# EAGLE design Z1 (EAGLE 9.6.2)
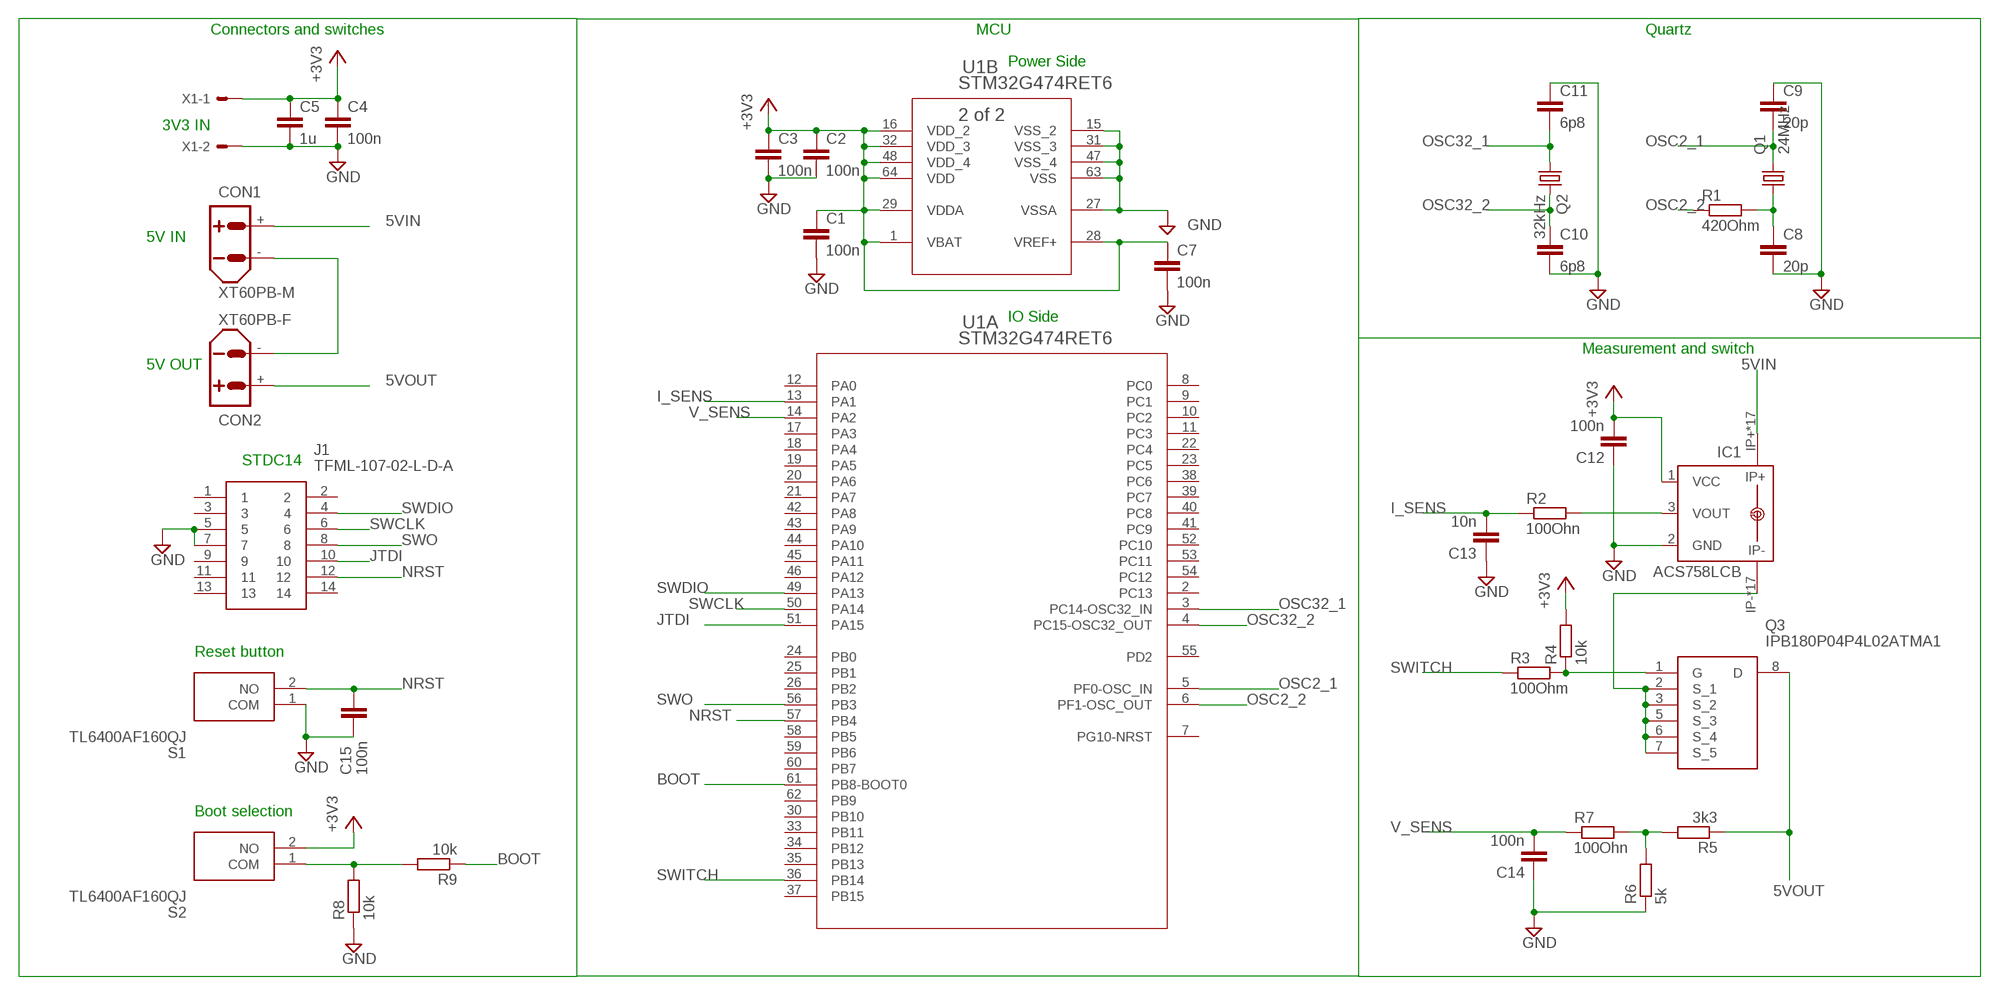
[diagram p0: schematic, sheet 1]

## Parts
C1  100n  C-EUC0402  [C0402]
C2  100n  C-EUC0402  [C0402]
C3  100n  C-EUC0402  [C0402]
C4  100n  C-EUC0402  [C0402]
C5  1u  C-EUC1206K  [C1206K]
C7  100n  C-EUC0402  [C0402]
C8  20p  C-EUC0402  [C0402]
C9  20p  C-EUC0402  [C0402]
C10  6p8  C-EUC0402  [C0402]
C11  6p8  C-EUC0402  [C0402]
C12  100n  C-EUC0402  [C0402]
C13  10n  C-EUC0402  [C0402]
C14  100n  C-EUC0402  [C0402]
C15  100n  C-EUC0402  [C0402]
CON1  XT60PB-M  [XT60PB-M]
CON2  XT60PB-F  [XT60PB-F]
IC1  ACS758LCB  ACS758LCB-050B-PFF-T  [CB-PFF]
J1  TFML-107-02-L-D-A  [TFML-107-02-XXX-D-A]
Q1  24MHz  KX-K  [11.4X4.5]
Q2  32kHz  FC-12M  [FC-12M]
Q3  IPB180P04P4L02ATMA1  [IPB180P04P4L02ATMA1]
R1  420Ohm  R-EU_R0603  [R0603]
R2  100Ohn  R-EU_R0603  [R0603]
R3  100Ohm  R-EU_R0603  [R0603]
R4  10k  R-EU_R0603  [R0603]
R5  3k3  R-EU_R0603  [R0603]
R6  5k  R-EU_R0603  [R0603]
R7  100Ohn  R-EU_R0603  [R0603]
R8  10k  R-EU_R0603  [R0603]
R9  10k  R-EU_R0603  [R0603]
S1  TL6400AF160QJ  [TL6400AF160QJ]
S2  TL6400AF160QJ  [TL6400AF160QJ]
U1  STM32G474RET6  [LQFP64-10X10MM]
X1  KK-156-2  [KK-156-2]

## Nets
5VIN: CON1.+ IC1.IP+ IC1.IP+@2(IP+) IC1.IP+@3(IP+) IC1.IP+@4(IP+) IC1.IP+@5(IP+) IC1.IP+@6(IP+) IC1.IP+@7(IP+) IC1.IP+@8(IP+) IC1.IP+@9(IP+) IC1.IP+@10(IP+) IC1.IP+@11(IP+) IC1.IP+@12(IP+) IC1.IP+@13(IP+) IC1.IP+@14(IP+) IC1.IP+@15(IP+) IC1.IP+@16(IP+) IC1.IP+@17(IP+)
5VOUT: CON2.+ Q3.8(D) R5.1
+3V3: C1.1 C2.1 C3.1 C4.1 C5.1 C7.1 C12.2 IC1.1(VCC) R4.2 S2.2(NO) U1.1(B:VBAT) U1.16(B:VDD_2) U1.28(B:VREF+) U1.29(B:VDDA) U1.32(B:VDD_3) U1.48(B:VDD_4) U1.64(B:VDD) X1.1
AXC: C8.1 Q1.1 R1.2
BOOT: R9.1 U1.61(A:PB8-BOOT0)
GND: C1.2 C2.2 C3.2 C4.2 C5.2 C7.2 C8.2 C9.1 C10.2 C11.1 C12.1 C13.1 C14.1 C15.2 IC1.2(GND) J1.5 J1.7 R6.1 R8.1 S1.1(COM) U1.15(B:VSS_2) U1.27(B:VSSA) U1.31(B:VSS_3) U1.47(B:VSS_4) U1.63(B:VSS) X1.2
I_SENS: C13.2 R2.1 U1.13(A:PA1)
JTDI: J1.10 U1.51(A:PA15)
N$1: CON1.- CON2.-
N$3: IC1.IP- IC1.IP-@2(IP-) IC1.IP-@3(IP-) IC1.IP-@4(IP-) IC1.IP-@5(IP-) IC1.IP-@6(IP-) IC1.IP-@7(IP-) IC1.IP-@8(IP-) IC1.IP-@9(IP-) IC1.IP-@10(IP-) IC1.IP-@11(IP-) IC1.IP-@12(IP-) IC1.IP-@13(IP-) IC1.IP-@14(IP-) IC1.IP-@15(IP-) IC1.IP-@16(IP-) IC1.IP-@17(IP-) Q3.2(S_1) Q3.3(S_2) Q3.5(S_3) Q3.6(S_4) Q3.7(S_5)
N$4: IC1.3(VOUT) R2.2
N$6: Q3.1(G) R3.2 R4.1
N$7: R5.2 R6.2 R7.2
N$8: R8.2 R9.2 S2.1(COM)
NRST: C15.1 J1.12 S1.2(NO) U1.57(A:PB4)
OSC2_1: C9.2 Q1.2 U1.5(A:PF0-OSC_IN)
OSC2_2: R1.1 U1.6(A:PF1-OSC_OUT)
OSC32_1: C11.2 Q2.1 U1.3(A:PC14-OSC32_IN)
OSC32_2: C10.1 Q2.2 U1.4(A:PC15-OSC32_OUT)
SWCLK: J1.6 U1.50(A:PA14)
SWDIO: J1.4 U1.49(A:PA13)
SWITCH: R3.1 U1.36(A:PB14)
SWO: J1.8 U1.56(A:PB3)
V_SENS: C14.2 R7.1 U1.14(A:PA2)
Unconnected: J1.1 J1.2 J1.3 J1.9 J1.11 J1.13 J1.14 U1.2(A:PC13) U1.7(A:PG10-NRST) U1.8(A:PC0) U1.9(A:PC1) U1.10(A:PC2) U1.11(A:PC3) U1.12(A:PA0) U1.17(A:PA3) U1.18(A:PA4) U1.19(A:PA5) U1.20(A:PA6) U1.21(A:PA7) U1.22(A:PC4) U1.23(A:PC5) U1.24(A:PB0) U1.25(A:PB1) U1.26(A:PB2) U1.30(A:PB10) U1.33(A:PB11) U1.34(A:PB12) U1.35(A:PB13) U1.37(A:PB15) U1.38(A:PC6) U1.39(A:PC7) U1.40(A:PC8) U1.41(A:PC9) U1.42(A:PA8) U1.43(A:PA9) U1.44(A:PA10) U1.45(A:PA11) U1.46(A:PA12) U1.52(A:PC10) U1.53(A:PC11) U1.54(A:PC12) U1.55(A:PD2) U1.58(A:PB5) U1.59(A:PB6) U1.60(A:PB7) U1.62(A:PB9)

## Notes on the sheet
- Connectors and switches | MCU | Quartz
- Power Side
- 3V3 IN
- 5V IN
- IO Side
- Measurement and switch
- 5V OUT
- STDC14
- Reset button
- Boot selection

## Library data of the parts
C1-C5 C7-C15 = rcl:C-EU: CAPACITOR, European symbol; SPICEPREFIX: C
CON1 CON2 = amass:XT60: AMASS XT60 connector Store in Japan AMASS XT60 connector <https://szc.jp/ams-xt60>
IC1 = allegro:ACS758*: Thermally Enhanced, Fully Integrated, Hall Effect-Based Linear Current Sensor with 100 micro Ohm Current Conductor display layer 49 Reference in BRD and place VIAs on circles Source: http://www.allegromicro.com/en/Products/Part_Numbers/0758/0758.pdf; MPN: ACS758LCB-050B-PFF-T; OC_FARNELL: 1718997; OC_NEWARK: 04R7131
J1 = TFML-107-02-L-D-A:TFML-107-02-L-D-A: Tiger Eye™ High-Reliability Locking Terminal Strip, 0.050" Pitch Source: Datasheet <https://componentsearchengine.com/Datasheets/1/TFML-107-02-L-D-A.pdf>; DESCRIPTION: Tiger Eye&trade; High-Reliability Locking Terminal Strip, 0.050&quot; Pitch; HEIGHT: mm; MANUFACTURER_NAME: SAMTEC; MANUFACTURER_PART_NUMBER: TFML-107-02-L-D-A; MOUSER_PART_NUMBER: 200-TFML10702LDA; MOUSER_PRICE-STOCK: https://www.mouser.com/Search/Refine.aspx?Keyword=200-TFML10702LDA
Q1 = crystal-geyer_V1_0:KX: Quartz Crystals (MHz) SMD: KX - Serie Model Size l/w/h [mm] Frequency Range Frequency Stability Temp. Range [°C] Load Capacitance AECQ 200 availabel Datasheet KX-4 KX-5 KX-6 KX-7 KX-9A KX-9B KX-12A KX-12B KX-13 KX-20 KX-K KX-KS 1.6/1.2/0.3 2.0/1.6/0.45 2.5/2.0/0.55 3.2/2.5/0.8 5.0/3.2/1.0 5.0/3.2/1.1 6.0/3.5/1.1 6.0/3.5/1.0 7.0/5.0 /1.3 11.6/5.5/1.6 12.3/4.5/4.2 12.3/4.5/3.2 24.0 ~ 80.0 MHz 16.0 ~ 80.0 MHz 12.0 ~ 80.0 MHz 8.0 ~ 60.0 MHz 7,68 ~ 300,0 MHz 8,0 ~ 50,0 MHz 8,0 ~ 150,0 MHz 8,0 ~ 50,0 MHz 6,0 ~ 160,0 MHz 3,579 ~ 25,0 MHz 3,579 ~ 70,0 MHz 3,579 ~ 70,0 MHz ±10 … ±50ppm ±10 … ±50ppm ±10 … ±50ppm ±10 … ±50ppm ±10 … ±50ppm ±10 … ±50ppm ±10 … ±50ppm ±10 … ±50ppm ±10 … ±50ppm ±50ppm ±10 … ±50ppm ±10 … ±50ppm (*) -40°C …+85°C (*) -40°C …+125°C (*) -40°C …+125°C (*) -40°C …+125°C (*) -40°C …+105°C (*) -40°C …+105°C (*) -40°C …+125°C (*) -40°C …+105°C (*) -40°C …+105°C (*) -40°C …+105°C (*) -40°C …+85°C (*) -40°C …+85°C 8, 8…16 8, 8…16 10, 8…16 12, 7…20 16, 10…20 16, 10…20 16, 10…20 16, 12…20 16, 12…20 16, 12…20 16, 12…30 16, 12…30 - yes yes yes - - - - - - - - KX-4.pdf <http://www.geyer-electronic.de/uploads/tx_userartikelfrequenz/GEYER-KX-4.pdf> KX-5.pdf <http://www.geyer-electronic.de/uploads/tx_userartikelfrequenz/GEYER-KX-5.pdf> KX-6.pdf <http://www.geyer-electronic.de/uploads/tx_userartikelfrequenz/GEYER-KX-6.pdf> KX-7.pdf <http://www.geyer-electronic.de/uploads/tx_userartikelfrequenz/GEYER-KX-7.pdf> KX-9A.pdf <http://www.geyer-electronic.de/uploads/tx_userartikelfrequenz/GEYER-KX-9A.pdf> KX-9B.pdf <http://www.geyer-electronic.de/uploads/tx_userartikelfrequenz/GEYER-KX-9B.pdf> KX-12A.pdf <http://www.geyer-electronic.de/uploads/tx_userartikelfrequenz/GEYER-KX-12A.pdf> KX-12B.pdf <http://www.geyer-electronic.de/uploads/tx_userartikelfrequenz/GEYER-KX-12B.pdf> KX-13.pdf <http://www.geyer-electronic.de/uploads/tx_userartikelfrequenz/GEYER-KX-13.pdf> KX-20.pdf <http://www.geyer-electronic.de/uploads/tx_userartikelfrequenz/GEYER-KX-20.pdf> KX-K.pdf <http://www.geyer-electronic.de/uploads/tx_userartikelfrequenz/GEYER-KX-K.pdf> KX-KS.pdf <http://www.geyer-electronic.de/uploads/tx_userartikelfrequenz/GEYER-KX-KS.pdf> <http://www.geyer-electronic.de/fileadmin/template/img/logo-geyer-electronic.png> Details see: http://www.geyer-electronic.de/Frequenz-Produkte.9.0.html Created 2016-06-07, Hans Locher 2016 (C) Geyer Quartz Technology KX4,KX5,KX6,KX7,KX9A,KX9B,KX12A,KX12B,KX13,KX20,KXK,KXKS;1612;2016;2520;3225;5032;6035;7050;11655;12345;1,6x1,2;2,0x1,6;2,5x2,0;3,2x2,5;5,0x3,2;6,0x3,5;7,0x5,0;11,6x5,5;12,3x4,5;12,3x4,5;1.6x1.2;2.0x1.6;2.5x2.0;3.2x2.5;5.0x3.2;6.0x3.5;7.0x5.0;11.6x5.5;12.3x4.5;12.3x4.5;
Q2 = crystal:FC-12M: kHz RANGE CRYSTAL UNIT LOW PROFILE SMD Source: Epson Toyocom FC-12M.pdf
Q3 = IPB180P04P4L02ATMA1:IPB180P04P4L02ATMA1: MOSFET P-Ch -40V -180A D2PAK-6 OptiMOS-P2., Source: Datasheet <https://datasheet.datasheetarchive.com/originals/distributors/DKDS-30/598184.pdf>; DESCRIPTION: MOSFET P-Ch -40V -180A D2PAK-6 OptiMOS-P2.,; HEIGHT: 4.5mm; MANUFACTURER_NAME: Infineon; MANUFACTURER_PART_NUMBER: IPB180P04P4L02ATMA1; MOUSER_PART_NUMBER: 726-IPB180P04P4L02AT; MOUSER_PRICE-STOCK: https://www.mouser.co.uk/ProductDetail/Infineon-Technologies/IPB180P04P4L02ATMA1?qs=OwbwYO03UsIwGcVH%2Fkzh3w%3D%3D
R1-R9 = rcl:R-EU_: RESISTOR, European symbol; SPICEPREFIX: R
S1 S2 = TL6400AF160QJ:TL6400AF160QJ: Tactile Switch SPST-NO Top Actuated Surface Mount Source: Datasheet <https://sten-eswitch-13110800-production.s3.amazonaws.com/system/asset/product_line/data_sheet/178/TL6700.pdf>; DESCRIPTION: Tactile Switch SPST-NO Top Actuated Surface Mount; HEIGHT: 4.3mm; MANUFACTURER_NAME: E-Switch; MANUFACTURER_PART_NUMBER: TL6400AF160QJ; MOUSER_PART_NUMBER: 612-TL6400AF160QJ; MOUSER_PRICE-STOCK: https://www.mouser.co.uk/ProductDetail/E-Switch/TL6400AF160QJ?qs=t7xnP681wgXh9NC1jPxNOA%3D%3D
U1 = stm32g474ret3_2:STM32G474RET6; COPYRIGHT: Copyright (C) 2022 Ultra Librarian. All rights reserved.; MANUFACTURER_PART_NUMBER: STM32G474RET6; MFR_NAME: STMicroelectronics
X1 = con-molex:KK-156-2: KK 156 HEADER Source: http://www.molex.com/pdm_docs/sd/026604100_sd.pdf; MF: MOLEX; OC_FARNELL: unknown; OC_NEWARK: unknown

## Board
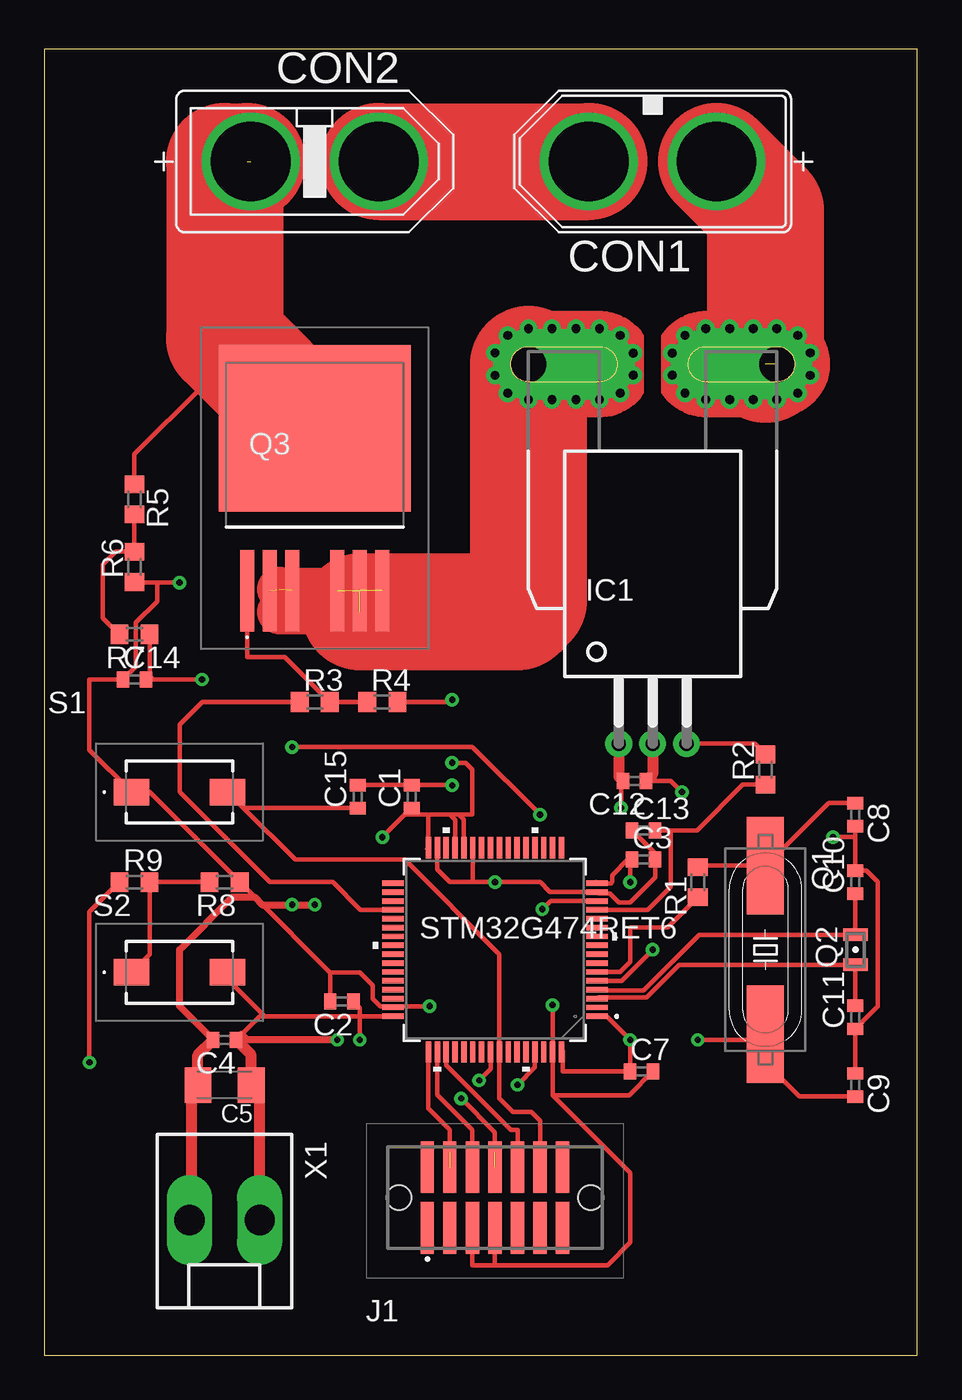
[diagram p1: board, top side]
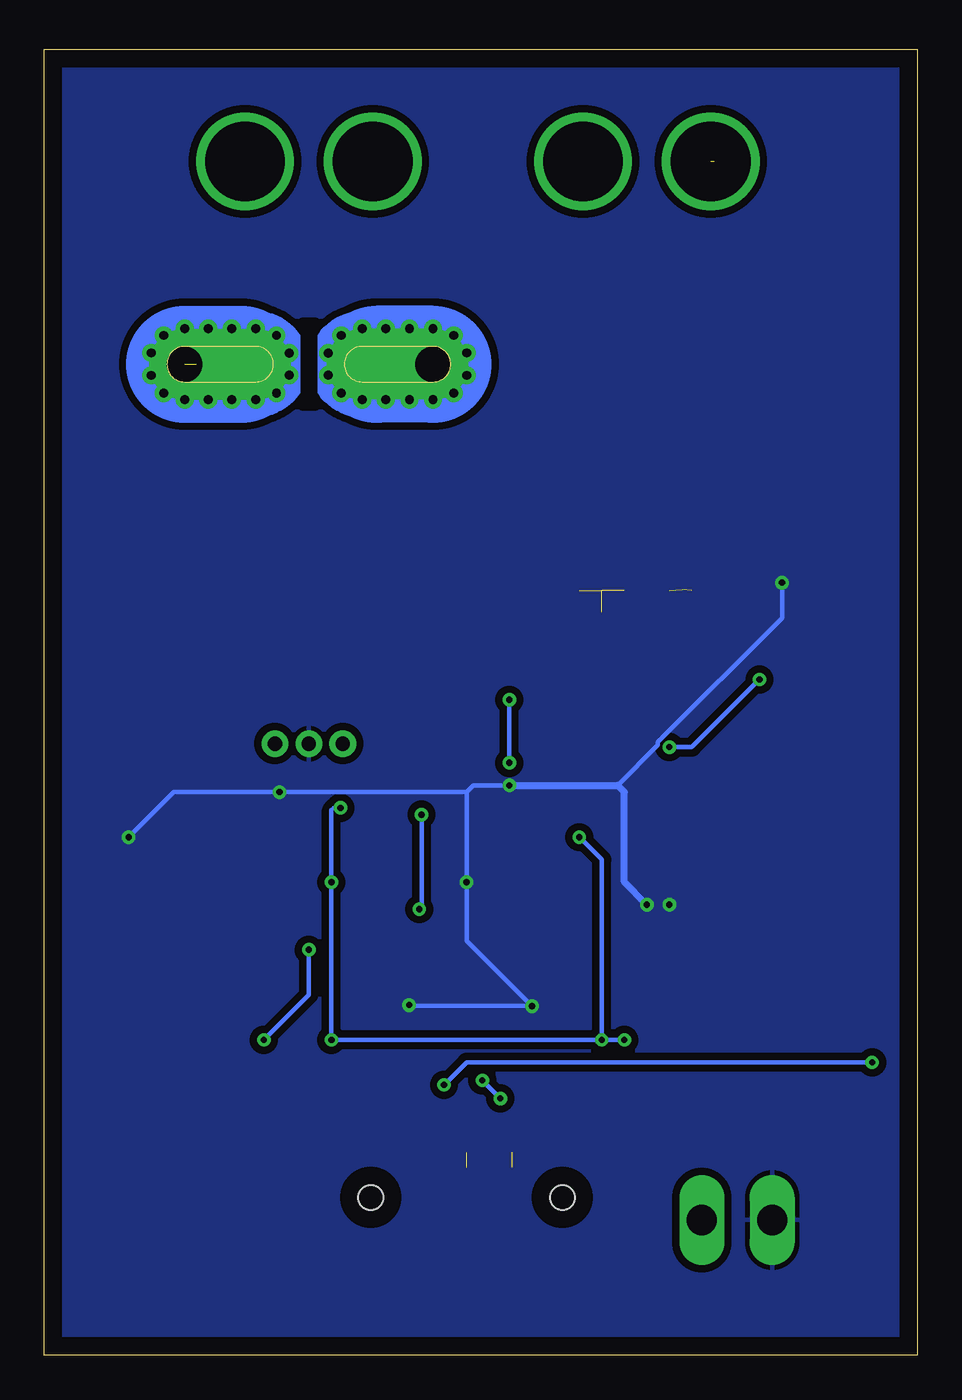
[diagram p2: board, bottom side, seen from below]

Size 49.2 x 73.65 mm. Coordinates in mm from the lower left corner, seen from the top.
Outline: 0,0 49.2,0 49.2,73.65 0,73.65 0,0
Copper layers (1*16): Top 0.035mm / dielectric 1.5mm / Bottom 0.035mm
Design rules "default": minimum track width 6mil, minimum drill 0.35mm, track to track 6mil, track to pad 6mil, pad to pad 6mil, via to via 6mil, smd to smd 6mil, copper to edge 40mil, drill to drill 6mil, minimum pad ring 10mil, minimum via ring 8mil, stop-mask expansion 4mil, vias tented up to drill 0mil, thermal gap 10mil

### Footprints (pad centres in the part's own frame; a part is rotated, then mirrored left to right if it is on the bottom)
C0402 = smd 0.7 x 0.9: 1 -0.65,0; 2 0.65,0
C1206K = smd 1.5 x 2: 1 -1.5,0; 2 1.5,0
XT60PB-M = drill 4.5: + 3.6,0; - -3.6,0
XT60PB-F = drill 4.5: + 3.6,0; - -3.6,0
CB-PFF = drill 0.8 pad 1.5: 1 -1.91,-21.4; 2 0,-21.4; 3 1.91,-21.4 | drill 2 pad 4 offset: IP+ 7,0; IP- -7,0 | drill 0.5 pad 0.9: IP+@2 8.89,0.635; IP+@3 8.89,-0.635; IP+@4 8.175,-1.625; IP+@5 7,-2; IP+@6 5.675,-2; IP+@7 4.35,-2; IP+@8 3,-2; IP+@9 1.825,-1.625; IP+@10 1.1,-0.625; IP+@11 1.1,0.625; IP+@12 1.825,1.625; IP+@13 3,2; IP+@14 4.35,2; IP+@15 5.675,2; IP+@16 7,2; IP+@17 8.175,1.625; IP-@2 -8.89,0.635; IP-@3 -8.89,-0.635; IP-@4 -8.175,-1.625; IP-@5 -7,-2; IP-@6 -5.675,-2; IP-@7 -4.325,-2; IP-@8 -3,-2; IP-@9 -1.825,-1.625; IP-@10 -1.1,-0.625; IP-@11 -1.1,0.625; IP-@12 -1.825,1.625; IP-@13 -3,2; IP-@14 -4.325,2; IP-@15 -5.675,2; IP-@16 -7,2; IP-@17 -8.175,1.625
TFML-107-02-XXX-D-A = smd 0.74 x 2.92: 1 -3.81,-1.715; 2 -3.81,1.715; 3 -2.54,-1.715; 4 -2.54,1.715; 5 -1.27,-1.715; 6 -1.27,1.715; 7 0,-1.715; 8 0,1.715; 9 1.27,-1.715; 10 1.27,1.715; 11 2.54,-1.715; 12 2.54,1.715; 13 3.81,-1.715; 14 3.81,1.715 | hole 1.4: -5.4,0; 5.4,0
11.4X4.5 = smd 5.5 x 2.08: 1 -4.75,0; 2 4.75,0
FC-12M = smd 0.7 x 1.4: 1 -0.85,0; 2 0.85,0
IPB180P04P4L02ATMA1 = smd 0.8 x 4.6: 1 -3.81,-6.425; 2 -2.54,-6.425; 3 -1.27,-6.425; 5 1.27,-6.425; 6 2.54,-6.425; 7 3.81,-6.425 | smd 10.8 x 9.4: 8 0,2.725
R0603 = smd 1 x 1.1: 1 -0.85,0; 2 0.85,0
TL6400AF160QJ = smd 2 x 1.5: 1 -2.7,0; 2 2.7,0
LQFP64-10X10MM = smd 1.194 x 0.305: 1 -5.75,3.75; 2 -5.75,3.25; 3 -5.75,2.75; 4 -5.75,2.25; 5 -5.75,1.75; 6 -5.75,1.25; 7 -5.75,0.75; 8 -5.75,0.25; 9 -5.75,-0.25; 10 -5.75,-0.75; 11 -5.75,-1.25; 12 -5.75,-1.75; 13 -5.75,-2.25; 14 -5.75,-2.75; 15 -5.75,-3.25; 16 -5.75,-3.75; 33 5.75,-3.75; 34 5.75,-3.25; 35 5.75,-2.75; 36 5.75,-2.25; 37 5.75,-1.75; 38 5.75,-1.25; 39 5.75,-0.75; 40 5.75,-0.25; 41 5.75,0.25; 42 5.75,0.75; 43 5.75,1.25; 44 5.75,1.75; 45 5.75,2.25; 46 5.75,2.75; 47 5.75,3.25; 48 5.75,3.75 | smd 0.305 x 1.194: 17 -3.75,-5.75; 18 -3.25,-5.75; 19 -2.75,-5.75; 20 -2.25,-5.75; 21 -1.75,-5.75; 22 -1.25,-5.75; 23 -0.75,-5.75; 24 -0.25,-5.75; 25 0.25,-5.75; 26 0.75,-5.75; 27 1.25,-5.75; 28 1.75,-5.75; 29 2.25,-5.75; 30 2.75,-5.75; 31 3.25,-5.75; 32 3.75,-5.75; 49 3.75,5.75; 50 3.25,5.75; 51 2.75,5.75; 52 2.25,5.75; 53 1.75,5.75; 54 1.25,5.75; 55 0.75,5.75; 56 0.25,5.75; 57 -0.25,5.75; 58 -0.75,5.75; 59 -1.25,5.75; 60 -1.75,5.75; 61 -2.25,5.75; 62 -2.75,5.75; 63 -3.25,5.75; 64 -3.75,5.75
KK-156-2 = drill 1.7 pad 2.184 long: 1 -1.98,0; 2 1.98,0

### Placement (x,y rotation side)
C1  20.7,31.5 90 top
C2  16.76,19.94 180 top
C3  33.78,27.94 0 top
C4  10.16,17.78 180 top
C5  10.16,15.24 180 top
C7  33.66,16 0 top
C8  45.72,30.48 270 top
C9  45.72,15.24 270 top
C10  45.72,26.67 90 top
C11  45.72,19.05 90 top
C12  33.27,32.38 180 top
C13  33.78,29.59 0 top
C14  5.08,38.1 0 top
C15  17.65,31.5 90 top
CON1  34.29,67.31 0 top
CON2  15.24,67.31 180 top
IC1  34.29,55.88 0 top
J1  25.4,8.89 0 top
Q1  40.64,22.86 270 top
Q2  45.72,22.86 90 top
Q3  15.24,49.53 0 top
R1  36.83,26.67 90 top
R2  40.64,33.02 90 top
R3  15.24,36.83 0 top
R4  19.05,36.83 0 top
R5  5.08,48.26 270 top
R6  5.08,44.45 90 top
R7  5.08,40.64 180 top
R8  10.16,26.67 180 top
R9  5.08,26.67 0 top
S1  7.62,31.75 0 top
S2  7.62,21.59 0 top
U1  25.4,22.86 180 top
X1  10.16,7.62 180 top

### Tracks (layer width: path | path; a pad name or v marks a point on that pad's centre or on a via)
5VIN  (1 unrouted)
  Top 6.604: CON1.+ 40.64,64.56 40.64,55.88
  Bottom 6.604: IC1.IP+ 38.1,55.88
5VOUT  (1 unrouted)
  Top 0.254: R5.1 5.08,50.8 8.89,54.61 12.88,54.61 Q3.8
  Top 6.604: Q3.8 10.16,57.34 10.16,67.31 11.43,67.31
+3V3  (via drill 0.35)
  Top 0.254: C4.1 11.12,18.09 12.14,19.11 12.42,19.11 | U1.48 17.78,19.11 | U1.64 29.21,17.17 29.21,16 C7.1 33.02,16.02 v33.02,17.78 31.69,19.11 U1.1 | 31.09,26.67 U1.16 31.94,26.61 32,26.67 32,27.05 32.89,27.94 C3.1 33.02,27.83 v33.02,26.67 32.96,26.61 | 23.11,28.57 U1.29 23.15,30.19 22.86,30.48 | 21.59,28.55 U1.32 21.65,30.42 | 17.78,19.11 v17.78,17.78 | v19.05,29.21 20.32,30.48 | 20.32,30.48 21.59,30.48 21.65,30.42 | 21.65,30.42 21.71,30.48 22.86,30.48 | 23.37,30.48 22.86,30.48 | U1.28 23.65,30.2 23.37,30.48 | 20.32,30.48 20.69,30.85 C1.1 | C2.1 17.78,19.57 17.78,19.11 | v32.51,30.86 32.51,32.27 C12.2 | S2.2 10.32,21.21 12.42,19.11 | 17.78,19.11 12.42,19.11 | 23.37,30.48 24.13,30.48 24.13,33.02 23.75,33.4 v22.99,33.4 | v22.99,36.96 22.86,36.83 R4.2
  Top 0.406: v16.51,17.78 11.43,17.78 11.12,18.09
  Top 0.61: X1.1 12.14,14.76 C5.1 11.66,16.93 C4.1 | IC1.1 32.38,32.63 C12.2
  Bottom 0.254: v17.78,17.78 v33.02,17.78 v33.02,26.67 33.02,30.73 32.89,30.86 v32.51,30.86 | v17.78,17.78 17.78,27.94 v19.05,29.21 | v17.78,17.78 v16.51,17.78 | v22.99,33.4 v22.99,36.96
AXC
  Top 0.254: C8.1 44.21,31.13 40.69,27.61 Q1.1 36.92,27.61 R1.2
BOOT  (via drill 0.35)
  Top 0.254: R9.1 2.54,24.98 v2.54,16.51 | v26.67,15.24 27.65,16.22 U1.61
  Bottom 0.254: v2.54,16.51 25.4,16.51 v26.67,15.24
GND  (via drill 0.35)
  Top 0.254: J1.5 24.13,5.08 25.4,5.08 | J1.7 25.4,5.08 | 25.4,5.08 31.75,5.08 33.02,6.35 33.02,10.29 28.65,14.66 | 28.65,14.66 U1.63 28.65,19.63 28.7,19.69 v28.64,19.75 | C9.1 C11.1 46.99,19.67 46.99,26.67 46.34,27.32 C10.2 45.72,29.21 | C8.2 45.72,29.21 | C13.1 34.43,28.29 C3.2 34.43,26.93 33.02,25.52 32.39,25.52 31.86,26.04 31.22,26.04 U1.15 28.5,26.11 27.94,26.67 v25.4,26.67 24.15,26.67 | R6.1 5.12,43.56 6.35,43.56 | 6.35,43.56 6.73,43.56 v7.62,43.56 | U1.47 19.58,19.68 | 19.58,19.68 18.94,19.68 18.52,20.1 18.52,20.85 17.78,21.59 16.11,21.59 16.11,21.57 | 16.11,21.57 C2.2 | C15.2 C1.2 22.97,32.15 v22.99,32.13 | U1.31 22.15,27.38 22.86,26.67 24.15,26.67 | 24.15,26.67 U1.27 | v21.72,19.69 21.71,19.68 19.58,19.68 | v35.94,31.75 35.31,32.38 C12.1 | v44.45,29.21 45.72,29.21 | C7.2 32.96,14.66 28.65,14.66 | 16.11,21.57 11.86,25.82 R8.1 5.93,31.75 S1.1 2.54,34.13 2.54,38.1 C14.1 5.15,38.82 5.15,41.31 6.35,42.5 6.35,43.56
  Top 0.406: C4.2 7.62,19.67 7.62,22.86 10.59,25.82 11.86,25.82 12.28,25.4 v13.97,25.4 v15.24,25.4
  Top 0.61: X1.2 8.28,7.72 8.28,14.86 C5.2 8.66,16.93 C4.2 | IC1.2 34.29,32.75 C12.1
  Bottom 0.254: 25.4,31.75 v25.4,26.67 25.4,23.37 v21.72,19.69 28.57,19.69 v28.64,19.75 | 25.4,31.75 25.02,32.13 v22.99,32.13 | 25.4,31.75 v35.94,31.75 41.91,31.75 v44.45,29.21 | 16.89,32.13 14.63,34.39 14.63,34.56 7.62,41.57 v7.62,43.56
  Bottom 0.406: v15.24,25.4 16.51,26.67 16.51,31.75 16.89,32.13 v22.99,32.13
  pour Bottom (isolate 0.406): 0,0 49.53,0 49.53,73.66 0,73.66
I_SENS
  Top 0.254: R2.1 39.37,32.17 36.79,29.59 C13.2 35.31,29.59 35.31,26.42 34,25.11 U1.13
JTDI
  Top 0.254: J1.10 26.67,12.7 26.29,12.7 22.65,16.34 U1.51
N$1
  Top 6.604: CON2.- CON1.-
N$3  (5 unrouted)
  Top 2.54: Q3.7 17.86,41.91 13.25,41.91 | Q3.5 13.33,43.1 13.25,43.18
  Top 6.604: IC1.IP- 27.29,42.53 26.67,41.91 17.78,41.91
  Bottom 6.604: IC1.IP- 30.48,55.88
N$4
  Top 0.254: IC1.3 40.03,34.48 R2.2
N$6
  Top 0.254: R4.1 R3.2 13.55,39.37 11.43,39.37 Q3.1
N$7
  Top 0.254: R5.2 R6.2 4.03,45.3 3.3,44.58 3.3,41.57 R7.2
N$8
  Top 0.254: R8.2 R9.2 5.93,22.6 S2.1
NRST
  Top 0.254: J1.12 27.94,13.21 27.43,13.72 26.42,13.72 25.65,14.48 U1.57 25.65,22.61 20.32,27.94 14.13,27.94 11.22,30.85 | S1.2 10.88,31.2 11.22,30.85 | C15.1 11.22,30.85
OSC2_1  (via drill 0.35)
  Top 0.254: C9.2 42.56,14.59 40.64,16.51 Q1.2 40.31,17.78 v36.83,17.78 | v34.29,22.86 32.54,21.11 U1.5
  Bottom 0.254: v36.83,17.78 34.29,20.32 v34.29,22.86
OSC2_2
  Top 0.254: R1.1 35.14,24.13 33.02,24.13 33.02,22.16 32.47,21.61 U1.6
OSC32_1
  Top 0.254: C11.2 Q2.1 35.79,22.01 33.95,20.17 31.21,20.17 U1.3
OSC32_2
  Top 0.254: C10.1 Q2.2 36.92,23.71 33.78,20.57 31.19,20.57 U1.4
SWCLK
  Top 0.254: U1.50 22.15,14.68 24.13,12.7 J1.6
SWDIO  (1 unrouted)
  Top 0.254: U1.49 21.65,13.91 22.86,12.7 22.86,11.43
SWITCH
  Top 0.254: R3.1 8.89,36.83 7.62,35.56 7.62,31.75 12.7,26.67 16.26,26.67 17.82,25.11 U1.36
SWO  (via drill 0.35)  (1 unrouted)
  Top 0.254: U1.56 25.15,16.13 v24.51,15.49 | v23.5,14.48 25.4,12.57 25.4,11.43
  Bottom 0.254: v24.51,15.49 v23.5,14.48
V_SENS  (via drill 0.35)
  Top 0.254: R7.1 5.93,38.3 | 5.93,38.3 C14.2 | U1.14 28.53,25.61 v28.07,25.15 | v27.94,30.48 24.13,34.29 v13.97,34.29 | v8.89,38.1 6.13,38.1 5.93,38.3
  Bottom 0.254: v28.07,25.15 27.94,25.27 v27.94,30.48 | v13.97,34.29 12.7,34.29 v8.89,38.1